# Altium schematic sheet DisplayInterface.SchDoc: Iris
size A3; Organization: Toradex AG; Address1: Altsagenstrasse 5; Address2: Horw; Address3: 6048; Address4: Switzerland; DocumentNumber: 9; Revision: V2.0; SheetNumber: 9; SheetTotal: 16
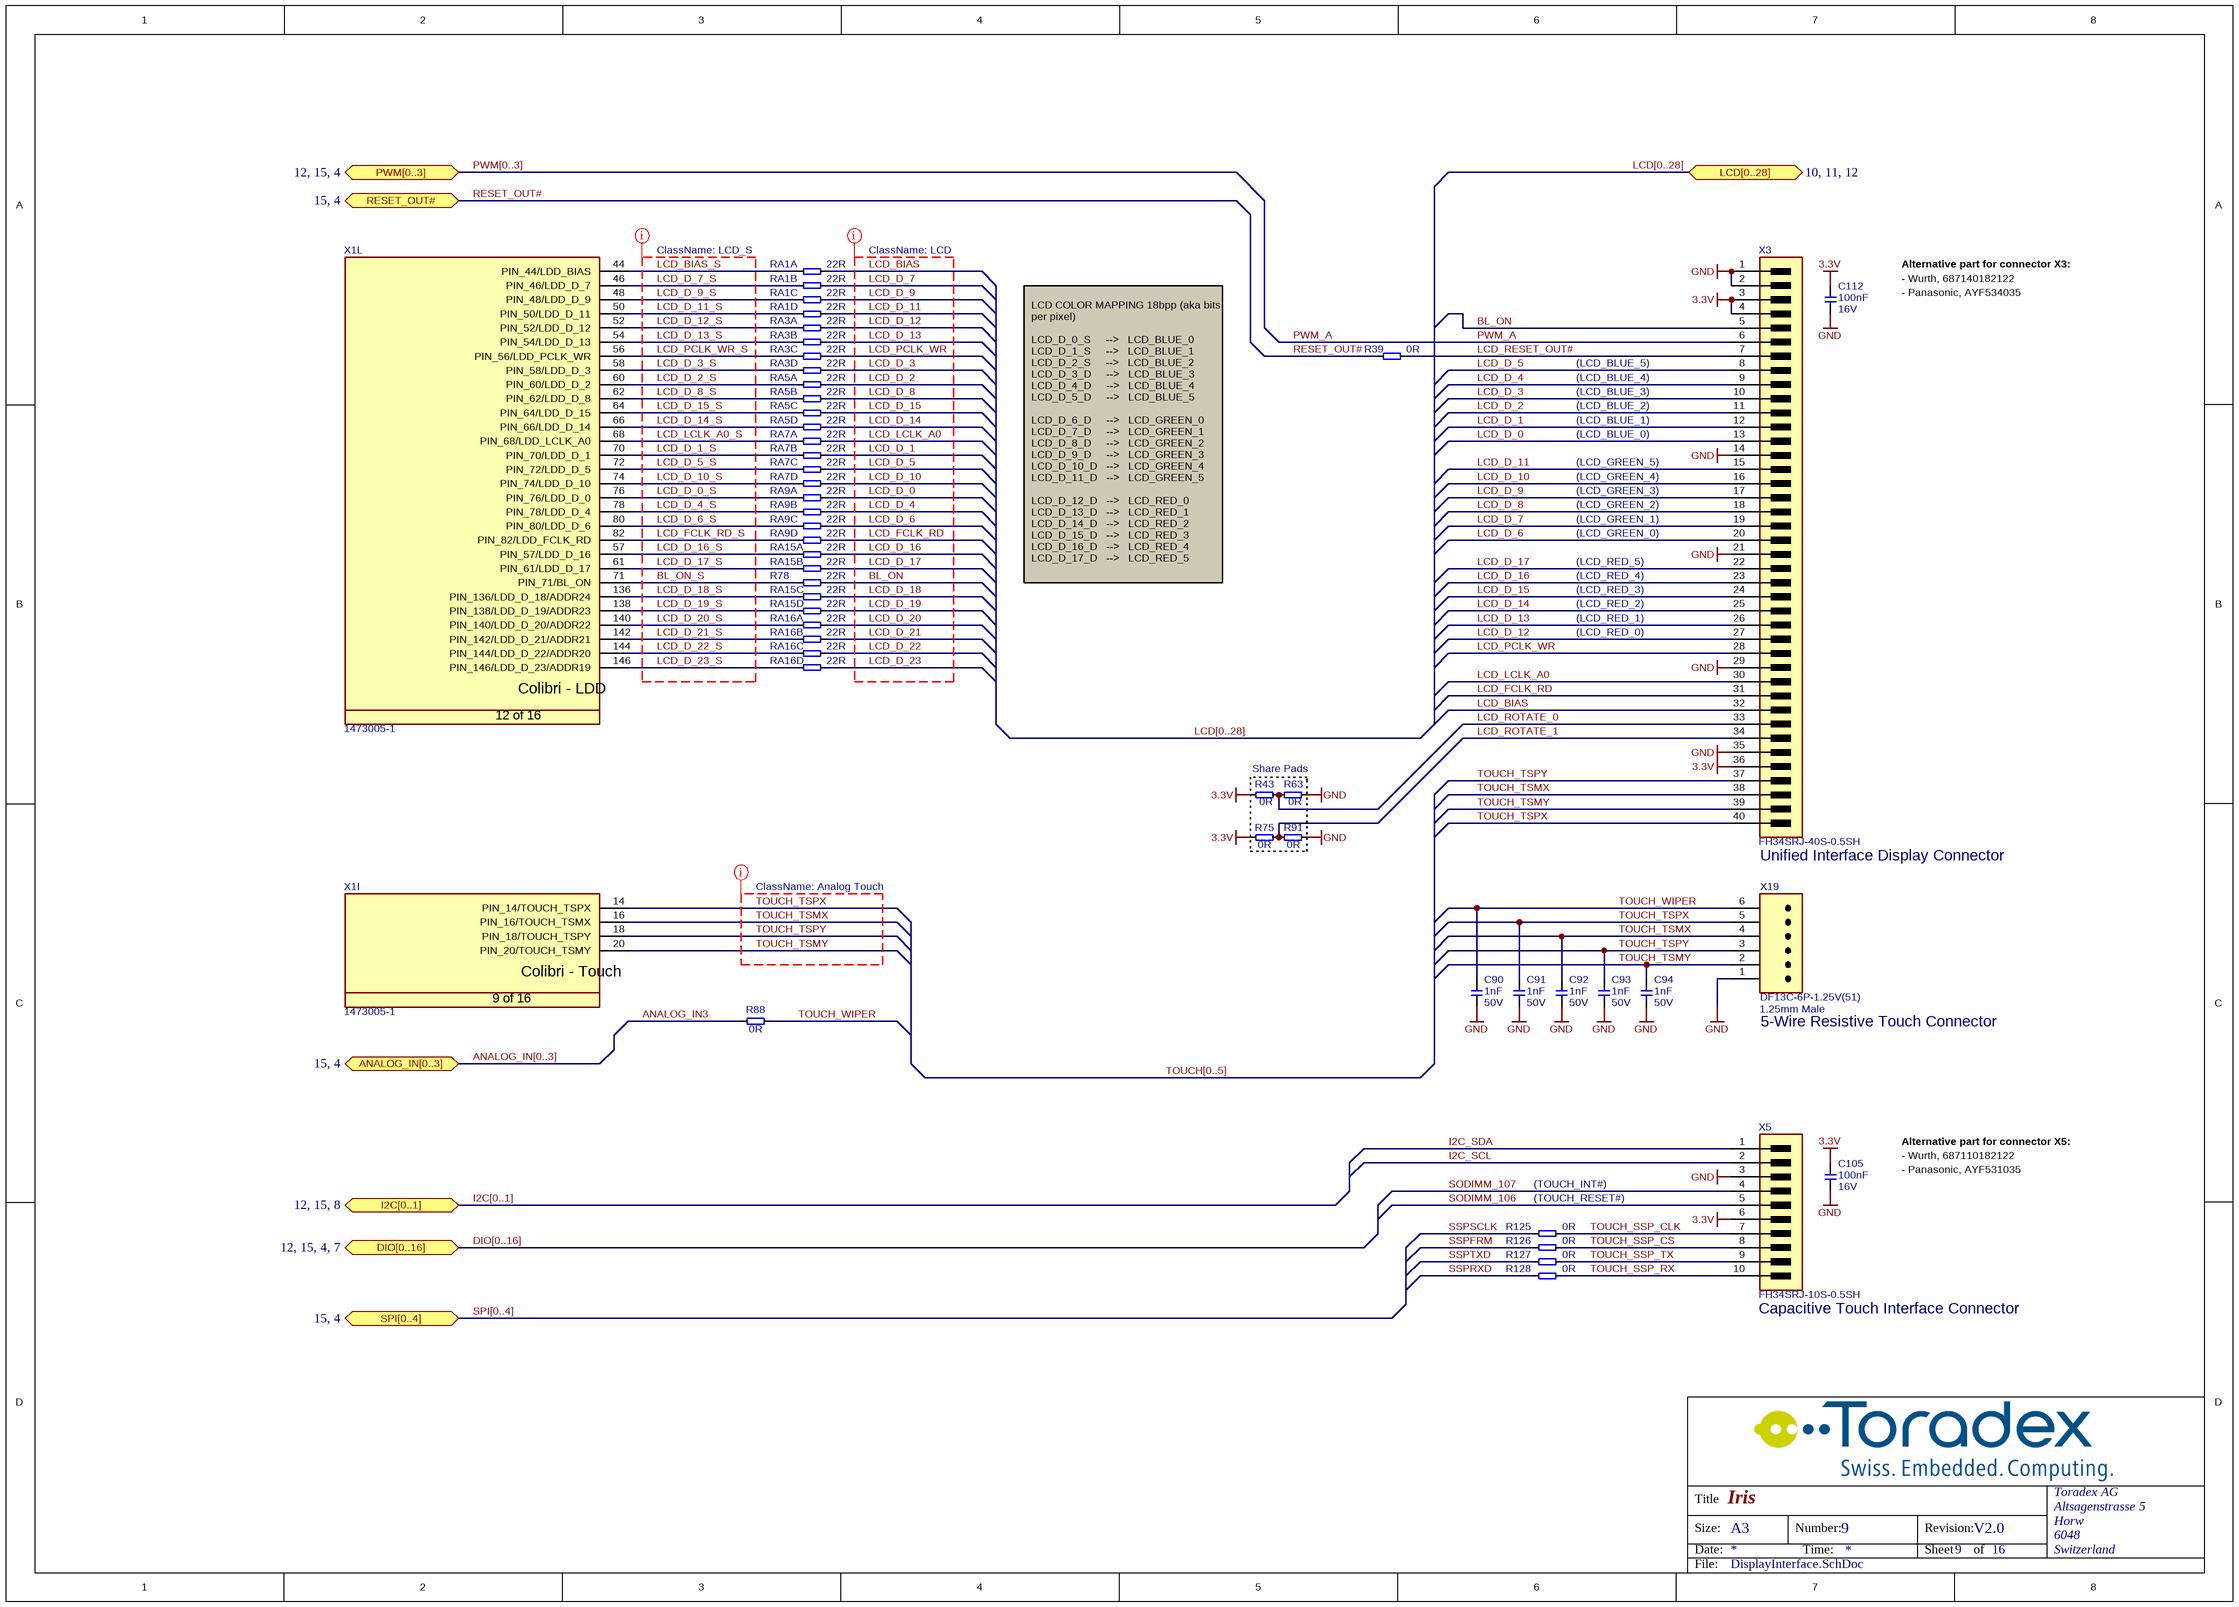
[diagram p0: DisplayInterface.SchDoc]

## Parts
C90  Rating: 50V  [CAPC1005X60N]  (hidden comment: 1nF)
C91  Rating: 50V  [CAPC1005X60N]  (hidden comment: 1nF)
C92  Rating: 50V  [CAPC1005X60N]  (hidden comment: 1nF)
C93  Rating: 50V  [CAPC1005X60N]  (hidden comment: 1nF)
C94  Rating: 50V  [CAPC1005X60N]  (hidden comment: 1nF)
C105  Rating: 16V  [CAPC1005X60N]  (hidden comment: 100nF)
C112  Rating: 16V  [CAPC1005X60N]  (hidden comment: 100nF)
R39  0R  [T_RESC0603X30N]
R43  0R  [T_RESC0603X30N]
R63  0R  [T_RESC0603X30N]
R75  0R  [T_RESC0603X30N]
R78  22R  [RESC1005X40N]
R88  0R  [T_RESC0603X30N]
R91  0R  [T_RESC0603X30N]
R125  0R  [T_RESC0603X30N]
R126  0R  [T_RESC0603X30N]
R127  0R  [T_RESC0603X30N]
R128  0R  [T_RESC0603X30N]
RA1  22R  [T_Resistor_Array_X4]  (parts A,B,C,D of 4)
RA3  22R  [T_Resistor_Array_X4]  (parts A,B,C,D of 4)
RA5  22R  [T_Resistor_Array_X4]  (parts A,B,C,D of 4)
RA7  22R  [T_Resistor_Array_X4]  (parts A,B,C,D of 4)
RA9  22R  [T_Resistor_Array_X4]  (parts A,B,C,D of 4)
RA15  22R  [T_Resistor_Array_X4]  (parts A,B,C,D of 4)
RA16  22R  [T_Resistor_Array_X4]  (parts A,B,C,D of 4)
X1  1473005-1  [T_Tyco_1473005-1]  (parts I,L of 16)
X3  FH34SRJ-40S-0.5SH  [T_Hirose_FH34SRJ-40S-0.5SH]
X5  FH34SRJ-10S-0.5SH  [T_Hirose_FH34SRJ-10S-0.5SH]
X19  DF13C-6P-1.25V(51)  [T_HIROSE_DF13C-6P-1.25V(51)]

## Blocks framed on the sheet
Share Pads: R43 R63 R75 R91

## Ports
ANALOG_IN[0..3] (bidir, see 15, 4), DIO[0..16] (bidir, see 12, 15, 4, 7), I2C[0..1] (bidir, see 12, 15, 8), LCD[0..28] (bidir, see 10, 11, 12), PWM[0..3] (bidir, see 12, 15, 4), RESET_OUT# (bidir, see 15, 4), SPI[0..4] (bidir, see 15, 4)

## Nets
3.3V: C105.2 C112.2 R43.1 R75.1 X3.3 X3.4 X3.36 X5.6
GND: C90.1 C91.1 C92.1 C93.1 C94.1 C105.1 C112.1 R63.2 R91.1 X3.1 X3.2 X3.14 X3.21 X3.29 X3.35 X5.3 X19.1(GND)
ANALOG_IN3: R88.2
BL_ON: R78.2 X3.5
BL_ON_S: R78.1 X1.71(PIN_71/BL_ON)
I2C_SCL: X5.2
I2C_SDA: X5.1
LCD_BIAS: RA1.5 X3.32
LCD_BIAS_S: RA1.1 X1.44(PIN_44/LDD_BIAS)
LCD_D_0: RA9.5 X3.13
LCD_D_0_S: RA9.1 X1.76(PIN_76/LDD_D_0)
LCD_D_1: RA7.6 X3.12
LCD_D_1_S: RA7.2 X1.70(PIN_70/LDD_D_1)
LCD_D_2: RA5.5 X3.11
LCD_D_2_S: RA5.1 X1.60(PIN_60/LDD_D_2)
LCD_D_3: RA3.8 X3.10
LCD_D_3_S: RA3.4 X1.58(PIN_58/LDD_D_3)
LCD_D_4: RA9.6 X3.9
LCD_D_4_S: RA9.2 X1.78(PIN_78/LDD_D_4)
LCD_D_5: RA7.7 X3.8
LCD_D_5_S: RA7.3 X1.72(PIN_72/LDD_D_5)
LCD_D_6: RA9.7 X3.20
LCD_D_6_S: RA9.3 X1.80(PIN_80/LDD_D_6)
LCD_D_7: RA1.6 X3.19
LCD_D_7_S: RA1.2 X1.46(PIN_46/LDD_D_7)
LCD_D_8: RA5.6 X3.18
LCD_D_8_S: RA5.2 X1.62(PIN_62/LDD_D_8)
LCD_D_9: RA1.7 X3.17
LCD_D_9_S: RA1.3 X1.48(PIN_48/LDD_D_9)
LCD_D_10: RA7.8 X3.16
LCD_D_10_S: RA7.4 X1.74(PIN_74/LDD_D_10)
LCD_D_11: RA1.8 X3.15
LCD_D_11_S: RA1.4 X1.50(PIN_50/LDD_D_11)
LCD_D_12: RA3.5 X3.27
LCD_D_12_S: RA3.1 X1.52(PIN_52/LDD_D_12)
LCD_D_13: RA3.6 X3.26
LCD_D_13_S: RA3.2 X1.54(PIN_54/LDD_D_13)
LCD_D_14: RA5.8 X3.25
LCD_D_14_S: RA5.4 X1.66(PIN_66/LDD_D_14)
LCD_D_15: RA5.7 X3.24
LCD_D_15_S: RA5.3 X1.64(PIN_64/LDD_D_15)
LCD_D_16: RA15.5 X3.23
LCD_D_16_S: RA15.1 X1.57(PIN_57/LDD_D_16)
LCD_D_17: RA15.6 X3.22
LCD_D_17_S: RA15.2 X1.61(PIN_61/LDD_D_17)
LCD_D_18: RA15.7
LCD_D_18_S: RA15.3 X1.136(PIN_136/LDD_D_18/ADDR24)
LCD_D_19: RA15.8
LCD_D_19_S: RA15.4 X1.138(PIN_138/LDD_D_19/ADDR23)
LCD_D_20: RA16.5
LCD_D_20_S: RA16.1 X1.140(PIN_140/LDD_D_20/ADDR22)
LCD_D_21: RA16.6
LCD_D_21_S: RA16.2 X1.142(PIN_142/LDD_D_21/ADDR21)
LCD_D_22: RA16.7
LCD_D_22_S: RA16.3 X1.144(PIN_144/LDD_D_22/ADDR20)
LCD_D_23: RA16.8
LCD_D_23_S: RA16.4 X1.146(PIN_146/LDD_D_23/ADDR19)
LCD_FCLK_RD: RA9.8 X3.31
LCD_FCLK_RD_S: RA9.4 X1.82(PIN_82/LDD_FCLK_RD)
LCD_LCLK_A0: RA7.5 X3.30
LCD_LCLK_A0_S: RA7.1 X1.68(PIN_68/LDD_LCLK_A0)
LCD_PCLK_WR: RA3.7 X3.28
LCD_PCLK_WR_S: RA3.3 X1.56(PIN_56/LDD_PCLK_WR)
LCD_RESET_OUT#: R39.2 X3.7
LCD_ROTATE_0: R43.2 R63.1 X3.33
LCD_ROTATE_1: R75.2 R91.2 X3.34
PWM_A: X3.6
RESET_OUT#: R39.1 ; port RESET_OUT#
SODIMM_106: X5.5
SODIMM_107: X5.4
SSPFRM: R126.1
SSPRXD: R128.1
SSPSCLK: R125.1
SSPTXD: R127.1
TOUCH_SSP_CLK: R125.2 X5.7
TOUCH_SSP_CS: R126.2 X5.8
TOUCH_SSP_RX: R128.2 X5.10
TOUCH_SSP_TX: R127.2 X5.9
TOUCH_TSMX: C92.2 X1.16(PIN_16/TOUCH_TSMX) X3.38 X19.4(TSMX)
TOUCH_TSMY: C94.2 X1.20(PIN_20/TOUCH_TSMY) X3.39 X19.2(TSMY)
TOUCH_TSPX: C91.2 X1.14(PIN_14/TOUCH_TSPX) X3.40 X19.5(TSPX)
TOUCH_TSPY: C93.2 X1.18(PIN_18/TOUCH_TSPY) X3.37 X19.3(TSPY)
TOUCH_WIPER: C90.2 R88.1 X19.6(WIPER)

## Buses and harness runs
bus ANALOG_IN[0..3] = port ANALOG_IN[0..3]
bus DIO[0..16] = port DIO[0..16]
bus I2C[0..1] = port I2C[0..1]
bus LCD[0..28] = port LCD[0..28]
bus PWM[0..3] = port PWM[0..3]
bus SPI[0..4] = port SPI[0..4]
bus TOUCH[0..5]

## Layout directives
net class Analog Touch: TOUCH_TSMX, TOUCH_TSMY, TOUCH_TSPX, TOUCH_TSPY
net class LCD: BL_ON, LCD_BIAS, LCD_D_0, LCD_D_1, LCD_D_2, LCD_D_3, LCD_D_4, LCD_D_5, LCD_D_6, LCD_D_7, LCD_D_8, LCD_D_9, LCD_D_10, LCD_D_11, LCD_D_12, LCD_D_13, LCD_D_14, LCD_D_15, LCD_D_16, LCD_D_17, LCD_D_18, LCD_D_19, LCD_D_20, LCD_D_21, LCD_D_22, LCD_D_23, LCD_FCLK_RD, LCD_LCLK_A0, LCD_PCLK_WR
net class LCD_S: BL_ON_S, LCD_BIAS_S, LCD_D_0_S, LCD_D_1_S, LCD_D_2_S, LCD_D_3_S, LCD_D_4_S, LCD_D_5_S, LCD_D_6_S, LCD_D_7_S, LCD_D_8_S, LCD_D_9_S, LCD_D_10_S, LCD_D_11_S, LCD_D_12_S, LCD_D_13_S, LCD_D_14_S, LCD_D_15_S, LCD_D_16_S, LCD_D_17_S, LCD_D_18_S, LCD_D_19_S, LCD_D_20_S, LCD_D_21_S, LCD_D_22_S, LCD_D_23_S, LCD_FCLK_RD_S, LCD_LCLK_A0_S, LCD_PCLK_WR_S

## Notes on the sheet
- Alternative part for connector X3:
- - Wurth, 687140182122
- - Panasonic, AYF534035
- (LCD_BLUE_2)
- (LCD_BLUE_3)
- (LCD_BLUE_4)
- (LCD_BLUE_5)
- (LCD_BLUE_0)
- (LCD_BLUE_1)
- (LCD_GREEN_4)
- (LCD_GREEN_5)
- (LCD_GREEN_0)
- (LCD_GREEN_1)
- (LCD_GREEN_2)
- (LCD_GREEN_3)
- LCD COLOR MAPPING 18bpp (aka bits
  per pixel)
  LCD_D_0_S     -->   LCD_BLUE_0
  LCD_D_1_S     -->   LCD_BLUE_1
  LCD_D_2_S     -->   LCD_BLUE_2
  LCD_D_3_D     -->   LCD_BLUE_3
  LCD_D_4_D     -->   LCD_BLUE_4
  LCD_D_5_D     -->   LCD_BLUE_5
  LCD_D_6_D     -->   LCD_GREEN_0
  LCD_D_7_D     -->   LCD_GREEN_1
  LCD_D_8_D     -->   LCD_GREEN_2
  LCD_D_9_D     -->   LCD_GREEN_3
  LCD_D_10_D   -->   LCD_GREEN_4
  LCD_D_11_D   -->   LCD_GREEN_5
  LCD_D_12_D   -->   LCD_RED_0
  LCD_D_13_D   -->   LCD_RED_1
  LCD_D_14_D   -->   LCD_RED_2
  LCD_D_15_D   -->   LCD_RED_3
  LCD_D_16_D   -->   LCD_RED_4
  LCD_D_17_D   -->   LCD_RED_5
- (LCD_RED_1)
- (LCD_RED_2)
- (LCD_RED_3)
- (LCD_RED_4)
- (LCD_RED_5)
- (LCD_RED_0)
- (near X3) Unified Interface Display Connector
- (near X19) 1.25mm Male
- (near X19) 5-Wire Resistive Touch Connector
- (TOUCH_INT#)
- (TOUCH_RESET#)
- Alternative part for connector X5:
- - Wurth, 687110182122
- - Panasonic, AYF531035
- (near X5) Capacitive Touch Interface Connector
- Title
- Size:
- Date:
- A3
- Number:
- Time:
- Revision:
- Sheet
- of
- File:
- (in symbol CON-Tyco-1473005-1-200-0.6mm, part I) Colibri - Touch; 9 of 16
- (in symbol CON-Tyco-1473005-1-200-0.6mm, part L) Colibri - LDD; 12 of 16

## Library data of the parts
C90-C94 = C-X7R-1nF-50V-10%-0402: Capacitor Ceramic X7R 1nF 50V 10% 0402; Tolerance: 10%; Type: X7R; Value: 1nF
C105 C112 = C-X7R-100nF-16V-10%-0402: Capacitor Ceramic X7R 100nF 16V 10% 0402; Tolerance: 10%; Type: X7R; Value: 100nF
R39 R43 R63 R75 R88 R91 R125-R128 = R-0R-63mW-5%-0603: Resistor 0 ohm 63mW 5% 0603; Rating: 63mW; Tolerance: 5%; Value: 0R; Size: 0603 (In)
R78 = R-22R-63mW-5%-0402: Resistor 22 ohm 63mW 5% 0402; Rating: 63mW; Tolerance: 5%; Value: 22R
RA1 RA3 RA5 RA7 RA9 RA15 RA16 = RA-22R-63mW-5%-1206-div: Resistor Array 22 R 63mW 5% 1206; Manufacturer Name: Generic; Tolerance: 5%; Power Dissipation: 63mW; Manufacturer Part Number: *; Value: 22R
X1 = CON-Tyco-1473005-1-200-0.6mm: SODIMM Connector; Manufacturer Name: Tyco; No. of ways: 200; Manufacturer Part No.: 1473005-1
X3 = CON-Hirose-FH34SRJ-40S-0.5SH: FFC Connector, 40 pin, 0.5mm pitch, dual side contact; Manufacturer Name: Hirose; No. of ways: 40; Pitch: 0.5mm; Manufacturer Part No.: FH34SRJ-40S-0.5SH
X5 = CON-Hirose-FH34SRJ-10S-0.5SH: FFC Connector, 10 pin, 0.5mm pitch, dual side contact; Manufacturer Name: Hirose; No. of ways: 10; Pitch: 0.5mm; Manufacturer Part No.: FH34SRJ-10S-0.5SH
X19 = CON-Hirose-DF13C-6P-1.25V(51)-1x6-1.25mm: Touch Connector; Manufacturer Name: Hirose; No. of ways: 1X6; Pitch: 1.25mm; Manufacturer Part No.: DF13C-6P-1.25V(51)